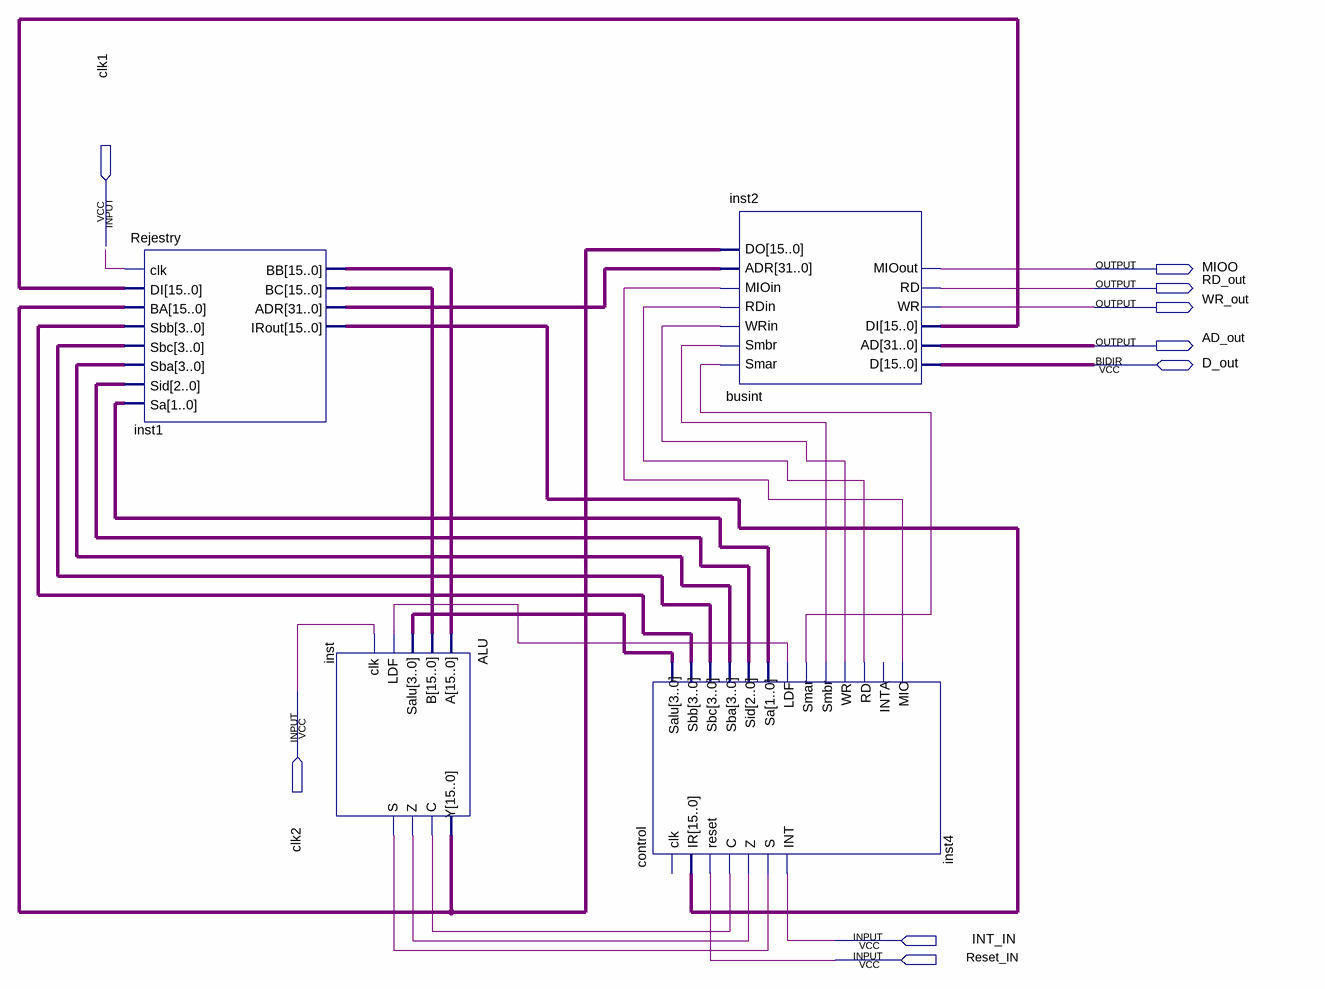
[diagram p0: schematic sheet]
// Quartus schematic Schemat.bdf as structural Verilog: 4 symbols, 9 pins
module Schemat (
  input  clk1,
  input  clk2,
  input  INT_IN,
  input  Reset_IN,
  inout  D_out,
  output MIOO,
  output RD_out,
  output WR_out,
  output AD_out
);

  wire inst4_ldf, inst4_mio, inst4_rd, inst4_smar, inst4_smbr, inst4_wr, inst_c, inst_s, inst_z;
  wire [1:0] inst4_sa;
  wire [2:0] inst4_sid;
  wire [3:0] inst4_salu, inst4_sba, inst4_sbb, inst4_sbc;
  wire [15:0] inst1_bb, inst1_bc, inst1_irout, inst2_d, inst2_di, inst_y;
  wire [31:0] inst1_adr, inst2_ad;

  Rejestry inst1 (
    .clk(clk1), .DI(inst2_di), .BA(inst_y), .Sbb(inst4_sbb), .Sbc(inst4_sbc), .Sba(inst4_sba),
    .Sid(inst4_sid), .Sa(inst4_sa), .BB(inst1_bb), .BC(inst1_bc), .ADR(inst1_adr), .IRout(inst1_irout));
  ALU inst (
    .A(inst1_bb), .B(inst1_bc), .Salu(inst4_salu), .LDF(inst4_ldf), .clk(clk2), .Y(inst_y), .C(inst_c),
    .Z(inst_z), .S(inst_s));
  control inst4 (
    .IR(inst1_irout), .reset(Reset_IN), .C(inst_c), .Z(inst_z), .S(inst_s), .INT(INT_IN), .Salu(inst4_salu),
    .Sbb(inst4_sbb), .Sbc(inst4_sbc), .Sba(inst4_sba), .Sid(inst4_sid), .Sa(inst4_sa), .LDF(inst4_ldf),
    .Smar(inst4_smar), .Smbr(inst4_smbr), .WR(inst4_wr), .RD(inst4_rd), .MIO(inst4_mio));  // open: clk, INTA
  busint inst2 (
    .Smar(inst4_smar), .Smbr(inst4_smbr), .WRin(inst4_wr), .RDin(inst4_rd), .MIOin(inst4_mio),
    .ADR(inst1_adr), .DO(inst_y), .AD(inst2_ad), .DI(inst2_di), .WR(WR_out), .RD(RD_out), .MIOout(MIOO),
    .D(inst2_d));
endmodule
